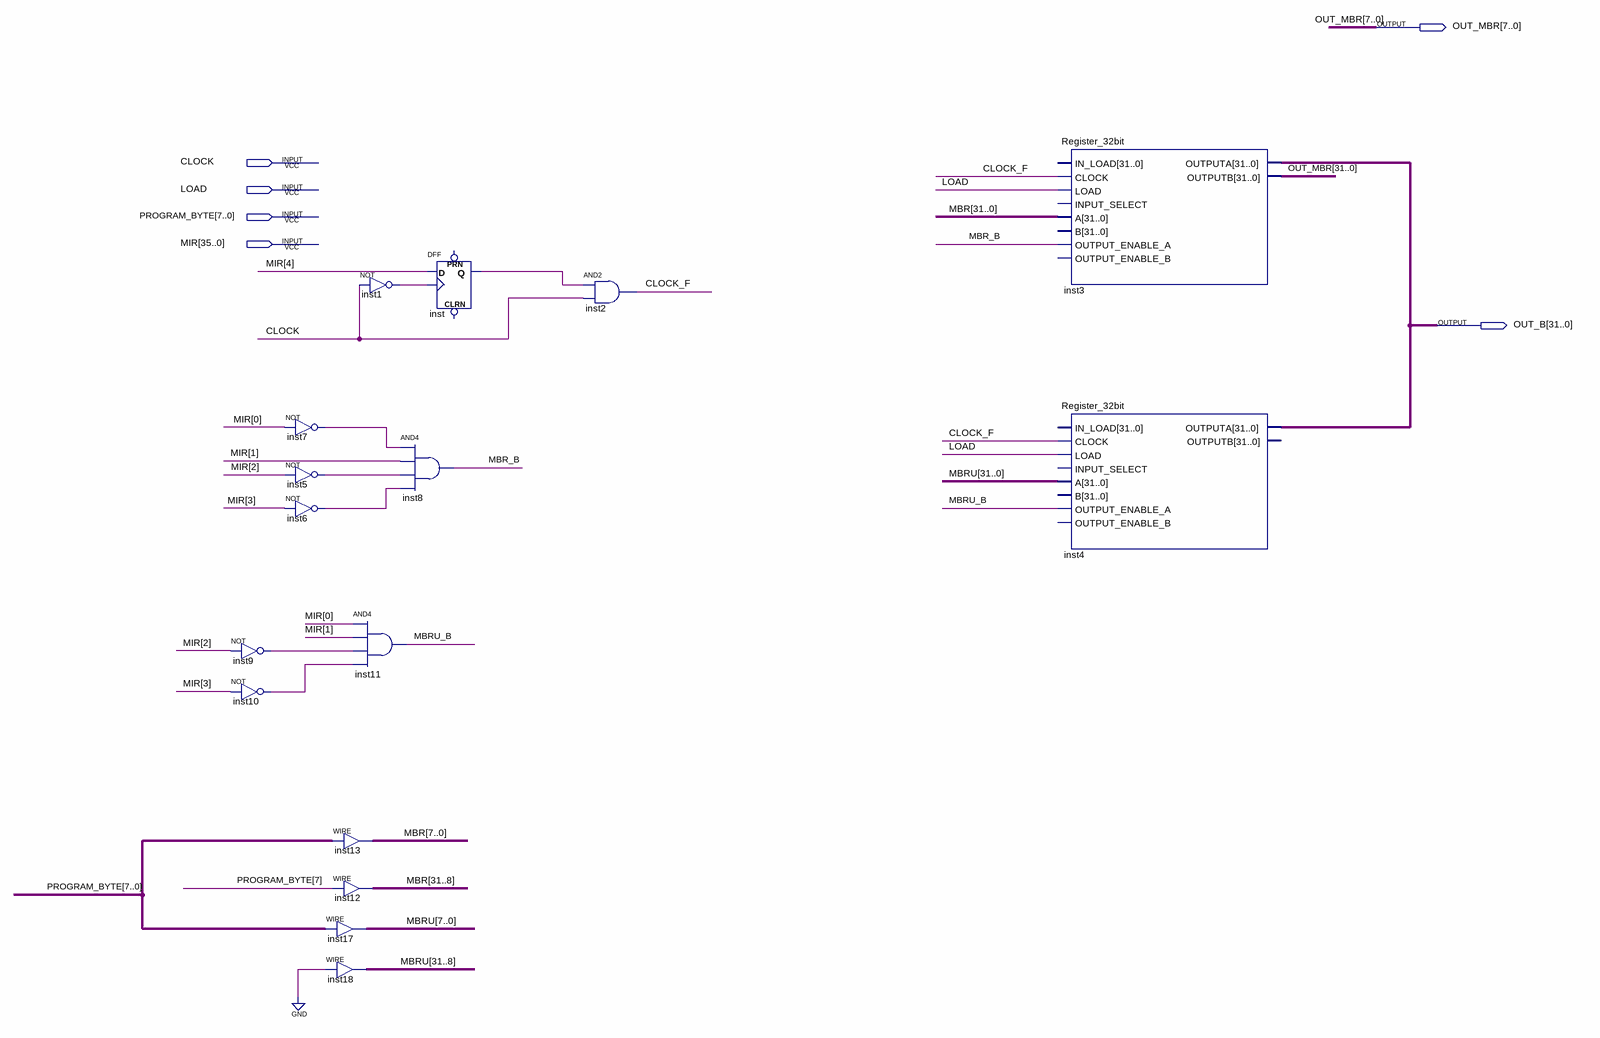
[diagram p0: schematic sheet]
// Quartus schematic MBR.bdf as structural Verilog: 16 symbols, 6 pins
module MBR (
  input  CLOCK,
  input  LOAD,
  input  [7:0] PROGRAM_BYTE,
  input  [35:0] MIR,
  output [31:0] OUT_MBR,
  output [31:0] OUT_B
);

  wire CLOCK_F, inst1_out, inst5_out, inst6_out, inst7_out, inst9_out, inst10_out, inst_q, MBR_B, MBRU_B;
  wire [31:0] MBR, MBRU;

  not inst9 (inst9_out, MIR[2]);
  not inst10 (inst10_out, MIR[3]);
  not inst7 (inst7_out, MIR[0]);
  not inst5 (inst5_out, MIR[2]);
  not inst6 (inst6_out, MIR[3]);
  not inst1 (inst1_out, CLOCK);
  and inst11 (MBRU_B, MIR[0], MIR[1], inst9_out, inst10_out);
  assign MBR[7:0] = PROGRAM_BYTE;  // WIRE inst13
  assign MBR[31:8] = {24{PROGRAM_BYTE[7]}};  // WIRE inst12
  assign MBRU[7:0] = PROGRAM_BYTE;  // WIRE inst17
  assign MBRU[31:8] = {24{1'b0}};  // WIRE inst18
  and inst8 (MBR_B, inst7_out, MIR[1], inst5_out, inst6_out);
  DFF inst (.CLK(inst1_out), .D(MIR[4]), .Q(inst_q));  // open: CLRN, PRN
  and inst2 (CLOCK_F, inst_q, CLOCK);
  Register_32bit inst3 (
    .CLOCK(CLOCK_F), .LOAD(LOAD), .A(MBR), .OUTPUT_ENABLE_A(MBR_B), .OUTPUTA(OUT_B), .OUTPUTB(OUT_MBR));  // open: IN_LOAD, INPUT_SELECT, B, OUTPUT_ENABLE_B
  Register_32bit inst4 (
    .CLOCK(CLOCK_F), .LOAD(LOAD), .A(MBRU), .OUTPUT_ENABLE_A(MBRU_B), .OUTPUTA(OUT_B));  // open: IN_LOAD, INPUT_SELECT, B, OUTPUT_ENABLE_B, OUTPUTB
endmodule
